# Altium schematic sheet 12-Mechanic.SchDoc: Mechanik
size A3; Engineer: Nader Aribi; Revision: 0.00; SheetNumber: 10; SheetTotal: 10; Version: 1.00; PageSetup: Record=PageOptions|CenterHorizontal=True|CenterVertical=True|PrintScale=1.01|XCorrection=1.00|YCorrection=1.00|PrintKind=0|BorderSize=5000000|LeftOffset=0|BottomOffset=0|Orientation=2|PaperLength=1000|PaperWidth=1000|Scale=100|PaperSource=15|PrintQuality=600|MediaType=1|DitherType=10|PrintScaleMode=1|PaperKind=A3
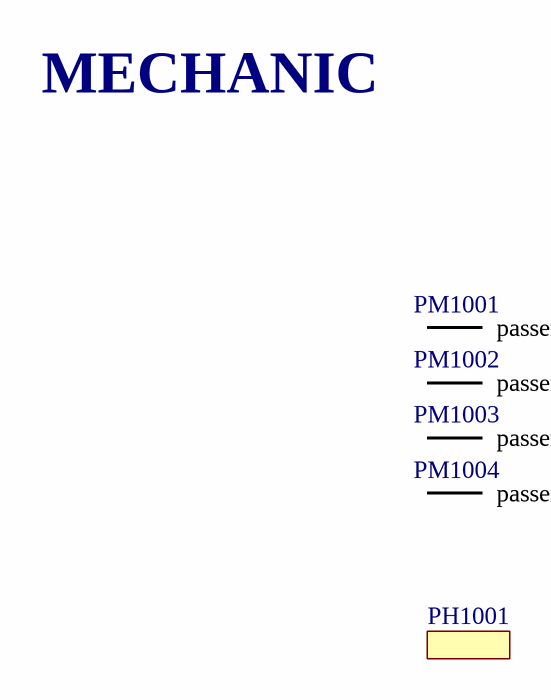
[diagram p0: 12-Mechanic.SchDoc]

## Parts
PH1001  PH_25MM00_8MM00  [PH_25MM00_8MM00_PCB]  (value not drawn)
PM1001  PM_1MM50_MM000  [PM_1MM50_PCB]  (value not drawn)
PM1002  PM_1MM50_MM000  [PM_1MM50_PCB]  (value not drawn)
PM1003  PM_1MM50_MM000  [PM_1MM50_PCB]  (value not drawn)
PM1004  PM_1MM50_MM000  [PM_1MM50_PCB]  (value not drawn)

## Nets

Not connected (* = marked no-connect by the designer): PM1001 1(passer_mark); PM1002 1(passer_mark); PM1003 1(passer_mark); PM1004 1(passer_mark)

## Notes on the sheet
- MECHANIC
- Title:
- Modified Date:
- SVN:
- AD Ver:
- Printed Date:
- Ver:
- Sheet Size:
- A3
- Sheet Name:
- OF
- Checked By:
- Drawn By:
- Rev:
- Alle Rechte vorbehalten. Kopien ohne Erlaubnis der X2E GmbH sind nicht gestattet. Dieses Dokument darf ohne die Erlaubnis der X2E GmbH nicht an Dritte (auch nicht in Auszügen) weitergegeben werden .
- Sheet:

## Library data of the parts
PH1001 = PH_25MM00_8MM00: Tag; library_path: Y:\lib\pads_stable\mechanic; dimension_a: 25MM0; dimension_b: 8MM00; editor_date: lavan,23.01.2013; footprint_path: Y:\lib\pads_stable; footprint_ref: PH_25MM00_8MM00_PCB; library_ref: PH_25MM00_8MM00
PM1001-PM1004 = PM_1MM50_MM000: passer mark; library_path: Y:\lib\pads_stable\mechanic; dimension_a: 1MM50; dimension_b: MM000; editor_date: lavan,14.01.2013; footprint_path: Y:\lib\pads_stable; footprint_ref: PM_1MM50_PCB; library_ref: PM_1MM50_MM000